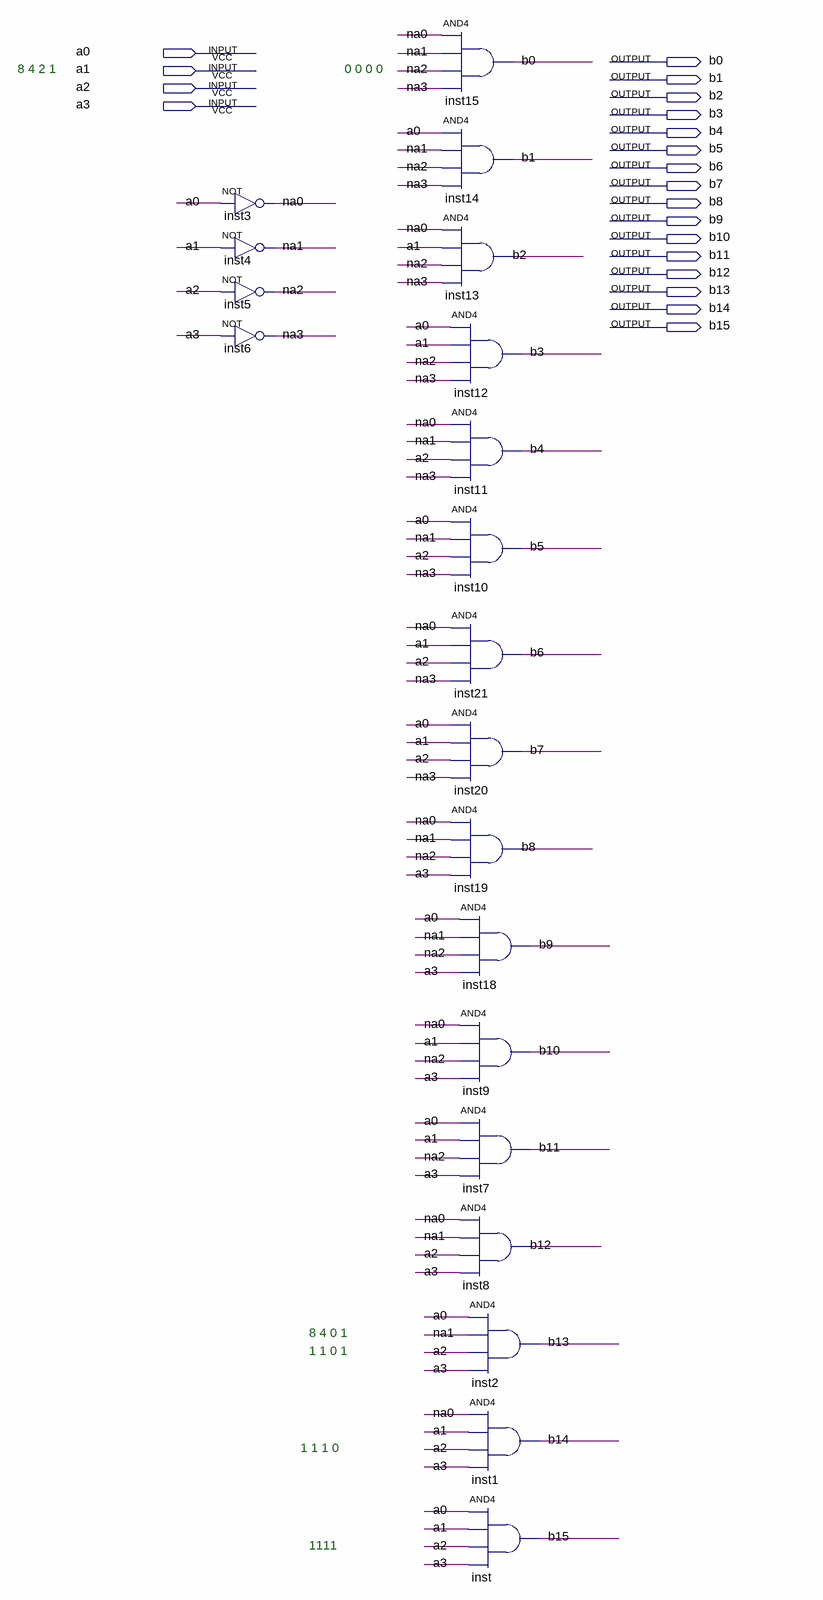
[diagram p0: schematic sheet]
// Quartus schematic dc.bdf as structural Verilog: 20 symbols, 20 pins
module dc (
  input  a0,
  input  a1,
  input  a2,
  input  a3,
  output b0,
  output b1,
  output b2,
  output b3,
  output b4,
  output b5,
  output b6,
  output b7,
  output b8,
  output b9,
  output b10,
  output b11,
  output b12,
  output b13,
  output b14,
  output b15
);

  wire na0, na1, na2, na3;

  not inst3 (na0, a0);
  not inst4 (na1, a1);
  not inst5 (na2, a2);
  not inst6 (na3, a3);
  and inst15 (b0, na0, na1, na2, na3);
  and inst14 (b1, a0, na1, na2, na3);
  and inst13 (b2, na0, a1, na2, na3);
  and inst12 (b3, a0, a1, na2, na3);
  and inst11 (b4, na0, na1, a2, na3);
  and inst10 (b5, a0, na1, a2, na3);
  and inst21 (b6, na0, a1, a2, na3);
  and inst20 (b7, a0, a1, a2, na3);
  and inst19 (b8, na0, na1, na2, a3);
  and inst18 (b9, a0, na1, na2, a3);
  and inst9 (b10, na0, a1, na2, a3);
  and inst7 (b11, a0, a1, na2, a3);
  and inst8 (b12, na0, na1, a2, a3);
  and inst2 (b13, a0, na1, a2, a3);
  and inst1 (b14, na0, a1, a2, a3);
  and inst (b15, a0, a1, a2, a3);

  // Notes on the sheet:
  //   8 4 2 1
  //   0 0 0 0
  //   8 4 0 1
  //   1 1 0 1
  //   1 1 1 0
  //   1111
endmodule
